# Altium schematic sheet STM32.SchDoc: STM32
size A4; SheetNumber: 3; SheetTotal: 4
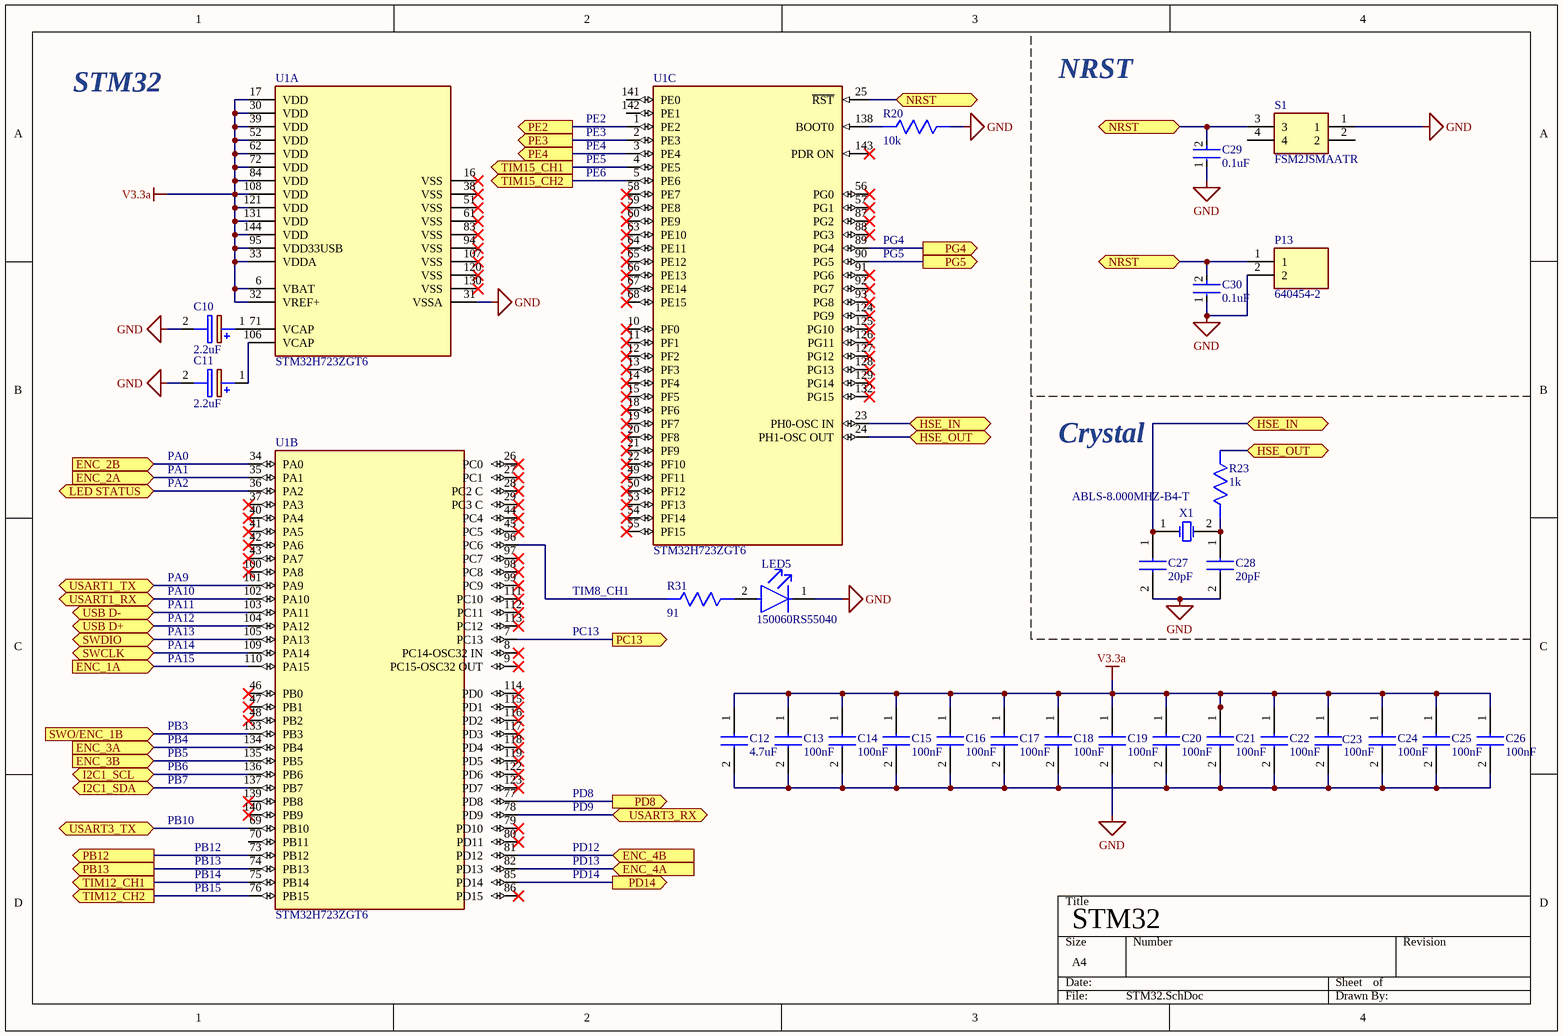
[diagram p0: STM32.SchDoc]

## Parts
C10  2.2uF  [T491D]
C11  2.2uF  [T491D]
C12  4.7uF  [C1608_Commercial]
C13  100nF  [C1608_Commercial]
C14  100nF  [C1608_Commercial]
C15  100nF  [C1608_Commercial]
C16  100nF  [C1608_Commercial]
C17  100nF  [C1608_Commercial]
C18  100nF  [C1608_Commercial]
C19  100nF  [C1608_Commercial]
C20  100nF  [C1608_Commercial]
C21  100nF  [C1608_Commercial]
C22  100nF  [C1608_Commercial]
C23  100nF  [C1608_Commercial]
C24  100nF  [C1608_Commercial]
C25  100nF  [C1608_Commercial]
C26  100nF  [C1608_Commercial]
C27  20pF  [CAPC1608X90N]
C28  20pF  [CAPC1608X90N]
C29  0.1uF  [FP-C1608-080-0_1-IPC_A]
C30  0.1uF  [FP-C1608-080-0_1-IPC_A]
LED5  150060RS55040  [FP-150060RS55040-MFG]
P13  640454-2  [HDRV2W66P0X254_1X2_762X572X1003P]
R20  10k  [RESC1608X55N]
R23  1k  [RESC1608X55N]
R31  91  [RESC1608X55N]
S1  FSM2JSMAATR  [FSM2J_1]
U1  STM32H723ZGT6  [FP-LQFP144-1A-IPC_C]  (parts A,B,C of 3)
X1  ABLS-8.000MHZ-B4-T  [ABRA-ABLS-14.7456MHZ-B2-T_V]

## Ports
ENC_1A (in, see Motor[2C]), ENC_2A (in, see Motor[4C]), ENC_2B (in, see Motor[3C]), ENC_3A (in, see Motor[1D]), ENC_3B (in, see Motor[1D]), ENC_4A (in, see Motor[2D]), ENC_4B (in, see Motor[2D]), HSE_IN (bidir, see STM32[3B]), HSE_IN (bidir, see STM32[4B]), HSE_OUT (bidir, see STM32[3B]), HSE_OUT (bidir, see STM32[4B]), I2C1_SCL (bidir), I2C1_SDA (bidir), LED STATUS (bidir), NRST (bidir, see Communication[1D], STM32[3A]), NRST (bidir, see Communication[1D], STM32[3A], STM32[3B]), PB12 (out), PB13 (out, see Motor[2A]), PC13 (out, see Motor[1B]), PD8 (out, see Motor[1A]), PD14 (out), PE2 (out), PE3 (out, see Motor[3A]), PE4 (out), PG4 (out, see Communication[2B]), PG5 (out, see Communication[3B]), SWCLK (bidir), SWDIO (bidir), SWO/ENC_1B (in, see Motor[2C]), TIM12_CH1 (out, see Motor[2A]), TIM12_CH2 (out, see Motor[1A]), TIM15_CH1 (out, see Motor[3A]), TIM15_CH2 (out, see Motor[1B]), USART1_RX (bidir), USART1_TX (bidir), USART3_RX (bidir), USART3_TX (bidir), USB D+ (bidir), USB D- (bidir)

## Nets
GND: C10.2(-) C11.2(-) C19.2 C27.2 C28.2 C29.1 C30.1 LED5.1(C) P13.2 R20.2 S1.1 U1.31(VSSA)
V3.3a: C12.1 C13.1 C14.1 C15.1 C16.1 C17.1 C18.1 C19.1 C20.1 C21.1 C22.1 C23.1 C24.1 C25.1 C26.1 U1.6(VBAT) U1.17(VDD) U1.30(VDD) U1.32(VREF+) U1.33(VDDA) U1.39(VDD) U1.52(VDD) U1.62(VDD) U1.72(VDD) U1.84(VDD) U1.95(VDD33USB) U1.108(VDD) U1.121(VDD) U1.131(VDD) U1.144(VDD)
ENC_1A: U1.110(PA15) ; port ENC_1A
ENC_2A: U1.35(PA1) ; port ENC_2A
ENC_2B: U1.34(PA0) ; port ENC_2B
ENC_3A: U1.134(PB4) ; port ENC_3A
ENC_3B: U1.135(PB5) ; port ENC_3B
ENC_4A: U1.82(PD13) ; port ENC_4A
ENC_4B: U1.81(PD12) ; port ENC_4B
HSE_IN: C27.1 U1.23(PH0-OSC_IN) X1.1(X1) ; port HSE_IN
HSE_OUT: R23.2 U1.24(PH1-OSC_OUT) ; port HSE_OUT
I2C1_SCL: U1.136(PB6) ; port I2C1_SCL
I2C1_SDA: U1.137(PB7) ; port I2C1_SDA
LED STATUS: U1.36(PA2) ; port LED STATUS
NRST: C29.2 C30.2 P13.1 S1.3 U1.25(~{RST}) ; port NRST
PB12: U1.73(PB12) ; port PB12
PB13: U1.74(PB13) ; port PB13
PC13: U1.7(PC13) ; port PC13
PD8: U1.77(PD8) ; port PD8
PD14: U1.85(PD14) ; port PD14
PE2: U1.1(PE2) ; port PE2
PE3: U1.2(PE3) ; port PE3
PE4: U1.3(PE4) ; port PE4
PG4: U1.89(PG4) ; port PG4
PG5: U1.90(PG5) ; port PG5
SWCLK: U1.109(PA14) ; port SWCLK
SWDIO: U1.105(PA13) ; port SWDIO
SWO/ENC_1B: U1.133(PB3) ; port SWO/ENC_1B
TIM12_CH1: U1.75(PB14) ; port TIM12_CH1
TIM12_CH2: U1.76(PB15) ; port TIM12_CH2
TIM15_CH1: U1.4(PE5) ; port TIM15_CH1
TIM15_CH2: U1.5(PE6) ; port TIM15_CH2
USART1_RX: U1.102(PA10) ; port USART1_RX
USART1_TX: U1.101(PA9) ; port USART1_TX
USART3_RX: U1.78(PD9) ; port USART3_RX
USART3_TX: U1.69(PB10) ; port USART3_TX
USB D+: U1.104(PA12) ; port USB D+
USB D-: U1.103(PA11) ; port USB D-
NetC10_1: C10.1(+) U1.71(VCAP)
NetC11_1: C11.1(+) U1.106(VCAP)
NetC12_2: C12.2 C13.2 C14.2 C15.2 C16.2 C17.2 C18.2 C20.2 C21.2 C22.2 C23.2 C24.2 C25.2 C26.2
NetC28_1: C28.1 R23.1 X1.2(X2)
NetLED5_2: LED5.2(A) R31.2
NetR20_1: R20.1 U1.138(BOOT0)
NetR31_1: R31.1 U1.96(PC6)

Not connected (* = marked no-connect by the designer): S1 2 4; U1 8(PC14-OSC32_IN)* 9(PC15-OSC32_OUT)* 10(PF0)* 11(PF1)* 12(PF2)* 13(PF3)* 14(PF4)* 15(PF5)* 16(VSS)* 18(PF6)* 19(PF7)* 20(PF8)* 21(PF9)* 22(PF10)* 26(PC0)* 27(PC1)* 28(PC2_C)* 29(PC3_C)* 37(PA3)* 38(VSS)* 40(PA4)* 41(PA5)* 42(PA6)* 43(PA7)* 44(PC4)* 45(PC5)* 46(PB0)* 47(PB1)* 48(PB2)* 49(PF11)* 50(PF12)* 51(VSS)* 53(PF13)* 54(PF14)* 55(PF15)* 56(PG0)* 57(PG1)* 58(PE7)* 59(PE8)* 60(PE9)* 61(VSS)* 63(PE10)* 64(PE11)* 65(PE12)* 66(PE13)* 67(PE14)* 68(PE15)* 70(PB11) 79(PD10)* 80(PD11)* 83(VSS)* 86(PD15)* 87(PG2)* 88(PG3)* 91(PG6)* 92(PG7)* 93(PG8)* 94(VSS)* 97(PC7)* 98(PC8)* 99(PC9)* 100(PA8)* 107(VSS)* 111(PC10)* 112(PC11)* 113(PC12)* 114(PD0)* 115(PD1)* 116(PD2)* 117(PD3)* 118(PD4)* 119(PD5)* 120(VSS)* 122(PD6)* 123(PD7)* 124(PG9)* 125(PG10)* 126(PG11)* 127(PG12)* 128(PG13)* 129(PG14)* 130(VSS)* 132(PG15)* 139(PB8)* 140(PB9)* 141(PE0) 142(PE1) 143(PDR_ON)*

## Notes on the sheet
- STM32
- NRST
- (near U1) PE5
- (near U1) PE6
- (near U1) PE4
- (near U1) PE3
- (near U1) PE2
- (near U1) PG4
- (near U1) PG5
- Crystal
- PA2
- PA1
- PA0
- PA9
- PA13
- PA14
- PA12
- PA11
- PA10
- PC13
- TIM8_CH1
- PA15
- PB3
- PB6
- PB7
- PB4
- PB5
- PB10
- PB12
- PD9
- PD8
- PD12
- PB15
- PB14
- PB13
- PD14
- PD13

## Library data of the parts
C10 C11 = T491D225K050AH: Capacitor Polarised; Manufacturer_Name: KEMET; Datasheet Link: https://content.kemet.com/datasheets/KEM_T2005_T491.pdf; Height: 3.1mm; Manufacturer_Part_Number: T491D225K050AH
C12-C26 = C1608X5R1H104M080AA: Capacitor; Manufacturer_Name: TDK; Datasheet Link: https://product.tdk.com/system/files/dam/doc/product/capacitor/ceramic/mlcc/catalog/mlcc_commercial_general_en.pdf; Height: 0.9mm; Manufacturer_Part_Number: C1608X5R1H104M080AA
C27 C28 = 06035A200FAT2A: Capacitor; Manufacturer_Name: AVX; Datasheet Link: https://componentsearchengine.com/Datasheets/1/06031A100FAT2A.pdf; Height: 0.9mm; Manufacturer_Part_Number: 06035A200FAT2A; Mouser Part Number: 581-06035A200FAT2A; Mouser Price/Stock: https://www.mouser.co.uk/ProductDetail/AVX/06035A200FAT2A?qs=0yaOSdwiqWsd0YnmvPoF5Q%3D%3D
C29 C30 = CMP-08246-002719-1: Multilayer Ceramic Capacitors 100nF ±10% 50V X5R SMD 0603; Radiation Hardening: No; Length: 1.6mm; Package Quantity: 1; Thickness: 0.035inch; Max Operating Temperature: 85°C; Series: C; RoHS Compliant: Yes; Weight: 7.1E-05oz; Resistor Type: Ceramic; Case/Package: 0603; Voltage Rating: 50V; Tolerance: 10%; Width: 0.031inch; Voltage Rating (DC): 50V; Termination: SMD/SMT; Case Code (Metric): 1608; Construction: Flat; Mount: Surface Mount; Capacitance: 100nF; Dielectric Material: Ceramic; Number of Pins: 2; Lead Free: Lead Free; Packaging: Tape and Reel; Min Operating Temperature: -55°C; Dielectric: X5R; Case Code (Imperial): 0603; Depth: 0.8mm; Height: 0.8mm; REACH SVHC: No SVHC
LED5 = CMP-207942-000007-1: LED RED DIFFUSED 0603 SMD; Lens Style: Flat; Lens Size: 0.8mm; Luminous Intensity: 90mcd; Test Current: 20mA; Forward Voltage: 2V; Dominant Wavelength: 624nm; Viewing Angle: 140°; Width: 0.8mm; Mount: Surface Mount; Height: 0.5mm; Case/Package: 0603; Packaging: Cut Tape; Length: 1.6mm; RoHS Compliant: No; Color: Red; Case Code (Imperial): 0603; Lens Transparency: Diffused; Case Code (Metric): 1608
P13 = 640454-2: Connector; Manufacturer_Name: TE Connectivity; Datasheet Link: https://datasheet.datasheetarchive.com/originals/distributors/Datasheets_SAMA/0152b3901a0ba380c7a54e62cba96e15.pdf; Height: 10.03mm; Manufacturer_Part_Number: 640454-2
R20 R23 R31 = CMP0603-FX-1003ELF: Resistor; Manufacturer_Name: Bourns; Datasheet Link: https://www.mouser.co.uk/datasheet/2/54/Bourns_CMP_Datasheet_05.28.20-1854233.pdf; Height: 0.55mm; Manufacturer_Part_Number: CMP0603-FX-1003ELF
S1 = FSM2JSMAATR: Switch; Manufacturer_Name: TE Connectivity; Datasheet Link: http://www.te.com/commerce/DocumentDelivery/DDEController?Action=showdoc&DocId=Customer+Drawing%7F2-1437565-7%7FV%7Fpdf%7FEnglish%7FENG_CD_2-1437565-7_V.pdf%7F2-1437565-9; Manufacturer_Part_Number: FSM2JSMAATR
U1 = CMP-12105-000148-1: IC MCU 32BIT 1MB FLASH 144LQFP
X1 = CMP-2000-05726-1: Low Profile Crystal, 8.0 MHz, +/- 30 ppm, -20 to 70 degC, 2-Pin SMD, RoHS, Tape and Reel; Brand: ABRACON; Case Length: 11.4mm; Frequency Stability: 50PPM; ESR: 80Ohms; Case Height: 4.2mm; Tolerance: 30PPM; Frequency: 8MHz; Case Width: 4.7mm; Load Capacitance: 18pF; Datasheet Version: 04/2011; Termination Style: SMD/SMT; Dimensions: 4.7mmWx11.4mmLx4.2mmH; Packaging: Reel; Manufacturer: ABRACON; Package URL: http://www.abracon.com/Support/PackageDrawing/Resonators/ABLS-2D.pdf; Mounting Technology: SurfaceMount; Package Reference: ABLS-14.7456MHZ-B2-T; Product Category: Crystals; Package Description: 2-Pin Surface Mount Device, Body 11.4 x 4.7 mm; Package / Case: HC-49/US; Mounting Style: SMD/SMT; Operating Temperature Range: -20Cto+70C; Series: ABLS; Factory Pack Quantity: 1000; Datasheet URL: http://www.abracon.com/Resonators/abls.pdf; Manufacturer URL: http://www.abracon.com/; RoHS: Details; Type: LowProfileMicroprocessorCrystal